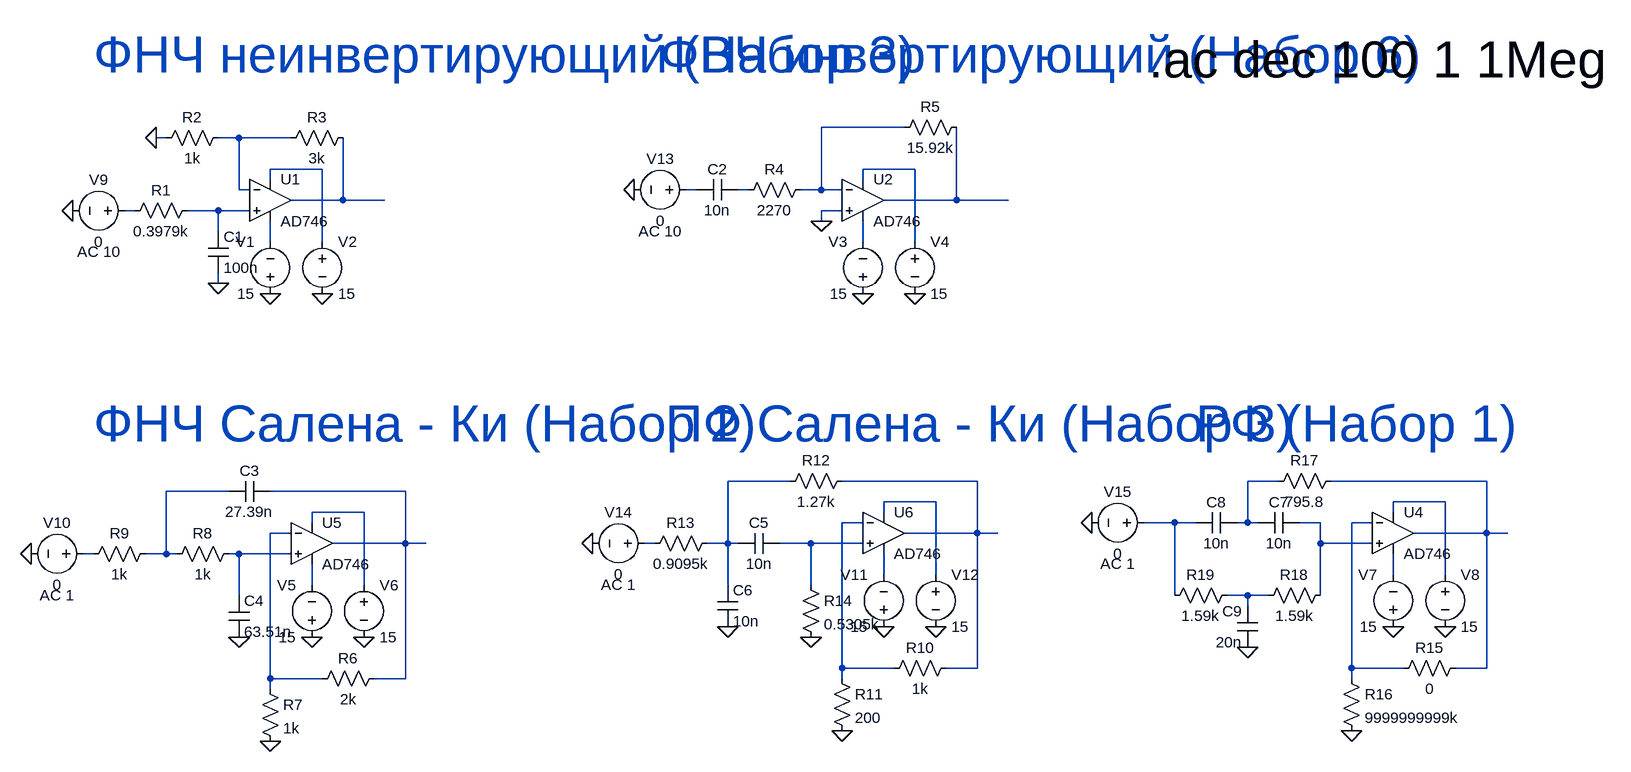
[diagram p0: schematic lab5.asc]
lab5.asc, the LTspice schematic file:
Version 4.1
SHEET 1 2196 1340
WIRE 1120 16 992 16
WIRE -16 32 -32 32
WIRE 96 32 64 32
WIRE 176 32 96 32
WIRE 224 80 144 80
WIRE 1136 80 1056 80
WIRE 144 96 144 80
WIRE 1056 96 1056 80
WIRE 96 112 96 32
WIRE 112 112 96 112
WIRE 800 112 784 112
WIRE 880 112 864 112
WIRE 992 112 992 16
WIRE 992 112 960 112
WIRE 1024 112 992 112
WIRE 256 128 256 32
WIRE 256 128 176 128
WIRE 320 128 256 128
WIRE 1200 128 1200 16
WIRE 1200 128 1088 128
WIRE 1280 128 1200 128
WIRE -64 144 -80 144
WIRE 64 144 16 144
WIRE 112 144 64 144
WIRE 1024 144 992 144
WIRE 992 160 992 144
WIRE 64 176 64 144
WIRE 144 192 144 160
WIRE 224 192 224 80
WIRE 1056 192 1056 160
WIRE 1136 192 1136 80
WIRE 64 256 64 240
WIRE 944 560 848 560
WIRE 1232 560 1024 560
WIRE 1696 560 1648 560
WIRE 2016 560 1776 560
WIRE 80 576 -16 576
WIRE 352 576 144 576
WIRE 1168 592 1088 592
WIRE 1952 592 1872 592
WIRE 288 608 208 608
WIRE 1088 608 1088 592
WIRE 1872 608 1872 592
WIRE 208 624 208 608
WIRE 1056 624 1024 624
WIRE 1536 624 1488 624
WIRE 1568 624 1536 624
WIRE 1648 624 1648 560
WIRE 1648 624 1632 624
WIRE 1664 624 1648 624
WIRE 1760 624 1728 624
WIRE 1840 624 1808 624
WIRE 176 640 144 640
WIRE 1232 640 1232 560
WIRE 1232 640 1120 640
WIRE 1264 640 1232 640
WIRE 2016 640 2016 560
WIRE 2016 640 1904 640
WIRE 2048 640 2016 640
WIRE 352 656 352 576
WIRE 352 656 240 656
WIRE 384 656 352 656
WIRE 736 656 720 656
WIRE 848 656 848 560
WIRE 848 656 816 656
WIRE 864 656 848 656
WIRE 976 656 928 656
WIRE 1056 656 976 656
WIRE 1760 656 1760 624
WIRE 1840 656 1760 656
WIRE -128 672 -144 672
WIRE -16 672 -16 576
WIRE -16 672 -48 672
WIRE 0 672 -16 672
WIRE 96 672 80 672
WIRE 176 672 96 672
WIRE 1088 704 1088 672
WIRE 1168 704 1168 592
WIRE 1872 704 1872 672
WIRE 1952 704 1952 592
WIRE 208 720 208 688
WIRE 288 720 288 608
WIRE 848 720 848 656
WIRE 976 720 976 656
WIRE 96 736 96 672
WIRE 1536 736 1536 624
WIRE 1648 736 1616 736
WIRE 1680 736 1648 736
WIRE 1760 736 1760 656
WIRE 1648 752 1648 736
WIRE 1024 848 1024 624
WIRE 1104 848 1024 848
WIRE 1232 848 1232 640
WIRE 1232 848 1184 848
WIRE 1808 848 1808 624
WIRE 1888 848 1808 848
WIRE 2016 848 2016 640
WIRE 2016 848 1968 848
WIRE 144 864 144 640
WIRE 224 864 144 864
WIRE 352 864 352 656
WIRE 352 864 304 864
WIRE 1024 864 1024 848
WIRE 1808 864 1808 848
WIRE 144 880 144 864
FLAG 64 256 0
FLAG -32 32 0
FLAG 992 160 0
FLAG 144 960 0
FLAG 96 800 0
FLAG 1024 944 0
FLAG 976 800 0
FLAG 848 784 0
FLAG 1808 944 0
FLAG 1648 816 0
FLAG -160 144 0
FLAG 704 112 0
FLAG 1408 624 0
FLAG 640 656 0
FLAG -224 672 0
FLAG 144 272 0
FLAG 224 272 0
FLAG 1056 272 0
FLAG 1136 272 0
FLAG 208 800 0
FLAG 288 800 0
FLAG 1088 784 0
FLAG 1168 784 0
FLAG 1872 784 0
FLAG 1952 784 0
SYMBOL OpAmps\\AD746 144 64 R0
SYMATTR InstName U1
SYMBOL OpAmps\\AD746 1056 64 R0
SYMATTR InstName U2
SYMBOL res 272 16 R90
WINDOW 0 0 56 VBottom 2
WINDOW 3 32 56 VTop 2
SYMATTR InstName R3
SYMATTR Value 3k
SYMBOL res 80 16 R90
WINDOW 0 0 56 VBottom 2
WINDOW 3 32 56 VTop 2
SYMATTR InstName R2
SYMATTR Value 1k
SYMBOL res 32 128 R90
WINDOW 0 0 56 VBottom 2
WINDOW 3 32 56 VTop 2
SYMATTR InstName R1
SYMATTR Value 0.3979k
SYMBOL res 1216 0 R90
WINDOW 0 0 56 VBottom 2
WINDOW 3 32 56 VTop 2
SYMATTR InstName R5
SYMATTR Value 15.92k
SYMBOL res 976 96 R90
WINDOW 0 0 56 VBottom 2
WINDOW 3 32 56 VTop 2
SYMATTR InstName R4
SYMATTR Value 2270
SYMBOL cap 48 176 R0
SYMATTR InstName C1
SYMATTR Value 100n
SYMBOL voltage 144 288 R180
WINDOW 0 24 96 Left 2
WINDOW 3 24 16 Left 2
WINDOW 123 0 0 Left 0
WINDOW 39 0 0 Left 0
SYMATTR InstName V1
SYMATTR Value 15
SYMBOL voltage 224 176 R0
WINDOW 123 0 0 Left 0
WINDOW 39 0 0 Left 0
SYMATTR InstName V2
SYMATTR Value 15
SYMBOL voltage 1056 288 R180
WINDOW 0 24 96 Left 2
WINDOW 3 24 16 Left 2
WINDOW 123 0 0 Left 0
WINDOW 39 0 0 Left 0
SYMATTR InstName V3
SYMATTR Value 15
SYMBOL voltage 1136 176 R0
WINDOW 123 0 0 Left 0
WINDOW 39 0 0 Left 0
SYMATTR InstName V4
SYMATTR Value 15
SYMBOL cap 864 96 R90
WINDOW 0 0 32 VBottom 2
WINDOW 3 32 32 VTop 2
SYMATTR InstName C2
SYMATTR Value 10n
SYMBOL OpAmps\\AD746 208 592 R0
SYMATTR InstName U5
SYMBOL voltage 208 816 R180
WINDOW 0 24 96 Left 2
WINDOW 3 24 16 Left 2
SYMATTR InstName V5
SYMATTR Value 15
SYMBOL voltage 288 704 R0
WINDOW 123 0 0 Left 0
WINDOW 39 0 0 Left 0
SYMATTR InstName V6
SYMATTR Value 15
SYMBOL res 320 848 R90
WINDOW 0 0 56 VBottom 2
WINDOW 3 32 56 VTop 2
SYMATTR InstName R6
SYMATTR Value 2k
SYMBOL res 128 864 R0
SYMATTR InstName R7
SYMATTR Value 1k
SYMBOL res 96 656 R90
WINDOW 0 0 56 VBottom 2
WINDOW 3 32 56 VTop 2
SYMATTR InstName R8
SYMATTR Value 1k
SYMBOL res -32 656 R90
WINDOW 0 0 56 VBottom 2
WINDOW 3 32 56 VTop 2
SYMATTR InstName R9
SYMATTR Value 1k
SYMBOL cap 144 560 R90
WINDOW 0 0 32 VBottom 2
WINDOW 3 32 32 VTop 2
SYMATTR InstName C3
SYMATTR Value 27.39n
SYMBOL cap 80 736 R0
SYMATTR InstName C4
SYMATTR Value 63.51n
SYMBOL OpAmps\\AD746 1088 576 R0
SYMATTR InstName U6
SYMBOL voltage 1088 800 R180
WINDOW 0 24 96 Left 2
WINDOW 3 24 16 Left 2
SYMATTR InstName V11
SYMATTR Value 15
SYMBOL voltage 1168 688 R0
WINDOW 123 0 0 Left 0
WINDOW 39 0 0 Left 0
SYMATTR InstName V12
SYMATTR Value 15
SYMBOL res 1200 832 R90
WINDOW 0 0 56 VBottom 2
WINDOW 3 32 56 VTop 2
SYMATTR InstName R10
SYMATTR Value 1k
SYMBOL res 1008 848 R0
SYMATTR InstName R11
SYMATTR Value 200
SYMBOL res 1040 544 R90
WINDOW 0 0 56 VBottom 2
WINDOW 3 32 56 VTop 2
SYMATTR InstName R12
SYMATTR Value 1.27k
SYMBOL cap 928 640 R90
WINDOW 0 0 32 VBottom 2
WINDOW 3 32 32 VTop 2
SYMATTR InstName C5
SYMATTR Value 10n
SYMBOL res 832 640 R90
WINDOW 0 0 56 VBottom 2
WINDOW 3 32 56 VTop 2
SYMATTR InstName R13
SYMATTR Value 0.9095k
SYMBOL res 960 704 R0
SYMATTR InstName R14
SYMATTR Value 0.5305k
SYMBOL cap 832 720 R0
SYMATTR InstName C6
SYMATTR Value 10n
SYMBOL OpAmps\\AD746 1872 576 R0
SYMATTR InstName U4
SYMBOL voltage 1872 800 R180
WINDOW 0 24 96 Left 2
WINDOW 3 24 16 Left 2
SYMATTR InstName V7
SYMATTR Value 15
SYMBOL voltage 1952 688 R0
WINDOW 123 0 0 Left 0
WINDOW 39 0 0 Left 0
SYMATTR InstName V8
SYMATTR Value 15
SYMBOL res 1984 832 R90
WINDOW 0 0 56 VBottom 2
WINDOW 3 32 56 VTop 2
SYMATTR InstName R15
SYMATTR Value 0
SYMBOL res 1792 848 R0
SYMATTR InstName R16
SYMATTR Value 9999999999k
SYMBOL res 1792 544 R90
WINDOW 0 0 56 VBottom 2
WINDOW 3 32 56 VTop 2
SYMATTR InstName R17
SYMATTR Value 795.8
SYMBOL cap 1728 608 R90
WINDOW 0 0 32 VBottom 2
WINDOW 3 32 32 VTop 2
SYMATTR InstName C7
SYMATTR Value 10n
SYMBOL cap 1632 608 R90
WINDOW 0 0 32 VBottom 2
WINDOW 3 32 32 VTop 2
SYMATTR InstName C8
SYMATTR Value 10n
SYMBOL cap 1664 816 R180
WINDOW 0 24 56 Left 2
WINDOW 3 24 8 Left 2
SYMATTR InstName C9
SYMATTR Value 20n
SYMBOL res 1776 720 R90
WINDOW 0 0 56 VBottom 2
WINDOW 3 32 56 VTop 2
SYMATTR InstName R18
SYMATTR Value 1.59k
SYMBOL res 1632 720 R90
WINDOW 0 0 56 VBottom 2
WINDOW 3 32 56 VTop 2
SYMATTR InstName R19
SYMATTR Value 1.59k
SYMBOL voltage -64 144 R90
WINDOW 0 -32 56 VBottom 2
WINDOW 3 32 56 VTop 2
WINDOW 123 48 56 VTop 2
WINDOW 39 0 0 Left 0
SYMATTR InstName V9
SYMATTR Value 0
SYMATTR Value2 AC 10
SYMBOL voltage -128 672 R90
WINDOW 0 -32 56 VBottom 2
WINDOW 3 32 56 VTop 2
WINDOW 123 48 56 VTop 2
WINDOW 39 0 0 Left 0
SYMATTR InstName V10
SYMATTR Value 0
SYMATTR Value2 AC 1
SYMBOL voltage 800 112 R90
WINDOW 0 -32 56 VBottom 2
WINDOW 3 32 56 VTop 2
WINDOW 123 48 56 VTop 2
WINDOW 39 0 0 Left 0
SYMATTR InstName V13
SYMATTR Value 0
SYMATTR Value2 AC 10
SYMBOL voltage 736 656 R90
WINDOW 0 -32 56 VBottom 2
WINDOW 3 32 56 VTop 2
WINDOW 123 48 56 VTop 2
WINDOW 39 0 0 Left 0
SYMATTR InstName V14
SYMATTR Value 0
SYMATTR Value2 AC 1
SYMBOL voltage 1504 624 R90
WINDOW 0 -32 56 VBottom 2
WINDOW 3 32 56 VTop 2
WINDOW 123 48 56 VTop 2
WINDOW 39 0 0 Left 0
SYMATTR InstName V15
SYMATTR Value 0
SYMATTR Value2 AC 1
TEXT -128 -96 Left 6 ;ФНЧ неинвертирующий (Набор 3)
TEXT 744 -96 Left 6 ;ФВЧ инвертирующий (Набор 6)
TEXT -128 472 Left 6 ;ФНЧ Салена - Ки (Набор 2)
TEXT 752 472 Left 6 ;ПФ Салена - Ки (Набор 3)
TEXT 1568 472 Left 6 ;РФ (Набор 1)
TEXT 1496 -88 Left 6 !.ac dec 100 1 1Meg

The netlist it stands for:
* lab5.asc
X§U1 N010 N002 N003 N011 N007 AD746  ; pins In+ In- V+ V- OUT
X§U2 0 N001 N004 N012 N008 AD746  ; pins In+ In- V+ V- OUT
R3 N007 N002 3k
R2 N002 0 1k
R1 N010 N009 0.3979k
R5 N008 N001 15.92k
R4 N001 N006 2270
C1 N010 0 100n
V1 0 N011 15
V2 N003 0 15
V3 0 N012 15
V4 N004 0 15
C2 N006 N005 10n
X§U5 N030 N026 N021 N033 N018 AD746  ; pins In+ In- V+ V- OUT
V5 0 N033 15
V6 N021 0 15
R6 N018 N026 2k
R7 N026 0 1k
R8 N030 N017 1k
R9 N017 N029 1k
C3 N018 N017 27.39n
C4 N030 0 63.51n
X§U6 N028 N022 N019 N031 N014 AD746  ; pins In+ In- V+ V- OUT
V11 0 N031 15
V12 N019 0 15
R10 N014 N022 1k
R11 N022 0 200
R12 N014 N013 1.27k
C5 N028 N013 10n
R13 N013 N027 0.9095k
R14 N028 0 0.5305k
C6 N013 0 10n
X§U4 N024 N025 N020 N032 N016 AD746  ; pins In+ In- V+ V- OUT
V7 0 N032 15
V8 N020 0 15
R15 N016 N025 0
R16 N025 0 9999999999k
R17 N016 N015 795.8
C7 N024 N015 10n
C8 N015 N023 10n
C9 0 N034 20n
R18 N024 N034 1.59k
R19 N034 N023 1.59k
V9 N009 0 0 AC 10
V10 N029 0 0 AC 1
V13 N005 0 0 AC 10
V14 N027 0 0 AC 1
V15 N023 0 0 AC 1
* ФНЧ неинвертирующий (Набор 3)
* ФВЧ инвертирующий (Набор 6)
* ФНЧ Салена - Ки (Набор 2)
* ПФ Салена - Ки (Набор 3)
* РФ (Набор 1)
.ac dec 100 1 1Meg
.backanno
.end